# Altium schematic sheet Power Supply.SchDoc
size 209 x 148 mm
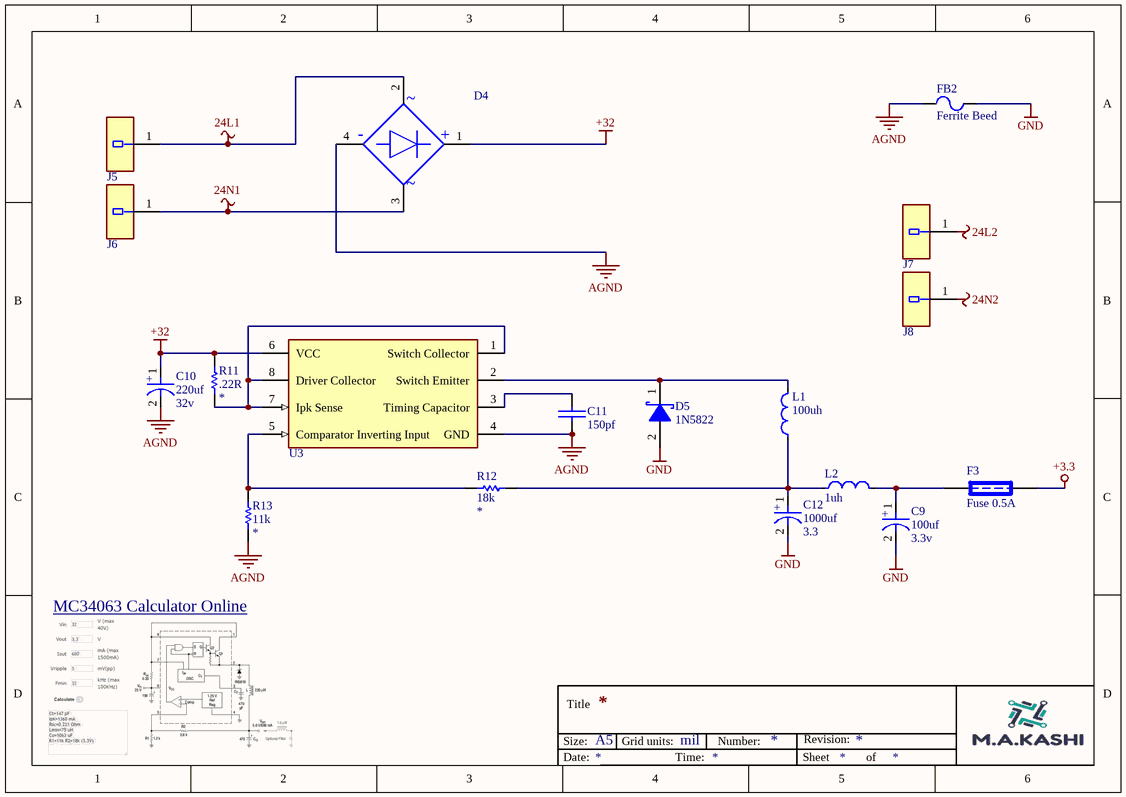
[diagram p0: Power Supply.SchDoc]

## Parts
C9  Capacitance: 100uf  Voltage: 3.3v  [CAP_electrolitic_8.3x10_Panasonic]  (hidden comment: Capacitor Electrolytic)
C10  Capacitance: 220uf  Voltage: 32v  [CAP_electrolitic_8.3x10_Panasonic]  (hidden comment: Capacitor Electrolytic)
C11  150pf  [cap_0805_A]
C12  Capacitance: 1000uf  Voltage: 3.3  [CAP_electrolitic_10x10.2_Panasonic]  (hidden comment: Capacitor Electrolytic)
D4  Bridge Rectifier  [Bridge Rectifier_Vishay_GBU_MFG]  (value not drawn)
D5  1N5822  [1N5822]
F3  Fuse 0.5A  [FUSE]
FB2  Ferrite Beed  [AXIAL-0.3]
J5  Quick-Fit  [Quick-Fit_Keystone_1287_0]  (value not drawn)
J6  Quick-Fit  [Quick-Fit_Keystone_1287_0]  (value not drawn)
J7  Quick-Fit  [Quick-Fit_Keystone_1287_0]  (value not drawn)
J8  Quick-Fit  [Quick-Fit_Keystone_1287_0]  (value not drawn)
L1  100uh  [INDUCTOR_SMD]
L2  1uh  [IND_DIP_7m]
R11  .22R  [RES_1206_A]
R12  18k  [RES_0805_A]
R13  11k  [RES_0805_A]
U3  MC33063ADR2G  [MC33063ADR2G_ON_Semiconductor_IPC_A]  (value not drawn)

## Nets
24L1: D4.2(1_~) J5.1
24L2: J7.1
24N1: D4.3(2_~) J6.1
24N2: J8.1
+3.3: F3.2
+32: C10.1(C) D4.1(+) R11.1 U3.6(VCC)
AGND: C10.2(A) C11.2 D4.4(-) FB2.2 R13.2 U3.4(GND)
GND: C9.2(A) C12.2(A) D5.2(Anode) FB2.1
NetC9_1: C9.1(C) F3.1 L2.2
NetC11_1: C11.1 U3.3(Timing_Capacitor)
NetC12_1: C12.1(C) L1.1 L2.1 R12.1
NetD5_1: D5.1(Cathode) L1.2 U3.2(Switch_Emitter)
NetR11_2: R11.2 U3.1(Switch_Collector) U3.7(Ipk_Sense) U3.8(Driver_Collector)
NetR12_2: R12.2 R13.1 U3.5(Comparator_Inverting_Input)

## Notes on the sheet
- MC34063 Calculator Online <https://www.bobtech.ro/tutoriale/componente-electronice/43-calculator-online-mc34063a-mc34063-step-down-step-up-inverter>
- Size:
- Title
- A5
- Grid units:
- mil
- Number:
- Revision:
- Date:
- Time:
- Sheet
- of
- (in symbol Bridge Rectifier) ~
- (in symbol Capacitor Electrolytic) +

## Library data of the parts
C11 = Capacitor: octopart or digikey description!; Part Number: *; Capacitance: 150pf; Voltage Rating: *
D4 = Bridge Rectifier: Part Number: GBL406
D5 = Schottky Diode: Part Number: 1N5822
F3 = Fuse: Published: 8-Jun-2000; LatestRevisionDate: 17-Jul-2002; LatestRevisionNote: Re-released for DXP Platform.; PackageReference: PIN-W2/E2.8; Publisher: Altium Limited
FB2 = Ferrite Beed: Code_IEC: 1005; Published: 8-Jun-2000; LatestRevisionDate: 17-Jul-2002; LatestRevisionNote: Re-released for DXP Platform.; PackageReference: 0402-A; Publisher: Altium Limited; Code_JEITA: 0402
L1 = Inductor: octopart or digikey description!; Part Number: NLV32T-101J-PF; Inductance: 100uh; Current Rating: *
L2 = Inductor: octopart or digikey description!; Part Number: *; Inductance: 1uh; Current Rating: *
R11-R13 = Resistor: octopart or digikey description!; Part Number: *; Voltage Rating: *; Power Rating: *; Tolerance: *
  R11: Resistance: .22R
  R12: Resistance: 18k
  R13: Resistance: 11k